# EAGLE schematic LED_Array (EAGLE 8.6.1)
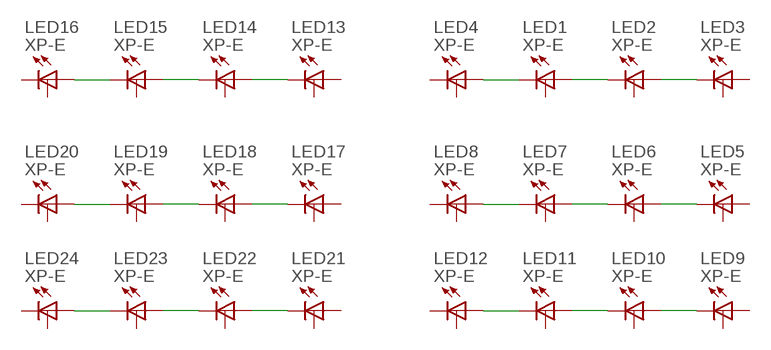
[diagram p0: schematic, sheet 1]

## Parts
LED1  XP-E  LED_W/THERM-XP-E  [CREE-XLAMP-XP-E]
LED2  XP-E  LED_W/THERM-XP-E  [CREE-XLAMP-XP-E]
LED3  XP-E  LED_W/THERM-XP-E  [CREE-XLAMP-XP-E]
LED4  XP-E  LED_W/THERM-XP-E  [CREE-XLAMP-XP-E]
LED5  XP-E  LED_W/THERM-XP-E  [CREE-XLAMP-XP-E]
LED6  XP-E  LED_W/THERM-XP-E  [CREE-XLAMP-XP-E]
LED7  XP-E  LED_W/THERM-XP-E  [CREE-XLAMP-XP-E]
LED8  XP-E  LED_W/THERM-XP-E  [CREE-XLAMP-XP-E]
LED9  XP-E  LED_W/THERM-XP-E  [CREE-XLAMP-XP-E]
LED10  XP-E  LED_W/THERM-XP-E  [CREE-XLAMP-XP-E]
LED11  XP-E  LED_W/THERM-XP-E  [CREE-XLAMP-XP-E]
LED12  XP-E  LED_W/THERM-XP-E  [CREE-XLAMP-XP-E]
LED13  XP-E  LED_W/THERM-XP-E  [CREE-XLAMP-XP-E]
LED14  XP-E  LED_W/THERM-XP-E  [CREE-XLAMP-XP-E]
LED15  XP-E  LED_W/THERM-XP-E  [CREE-XLAMP-XP-E]
LED16  XP-E  LED_W/THERM-XP-E  [CREE-XLAMP-XP-E]
LED17  XP-E  LED_W/THERM-XP-E  [CREE-XLAMP-XP-E]
LED18  XP-E  LED_W/THERM-XP-E  [CREE-XLAMP-XP-E]
LED19  XP-E  LED_W/THERM-XP-E  [CREE-XLAMP-XP-E]
LED20  XP-E  LED_W/THERM-XP-E  [CREE-XLAMP-XP-E]
LED21  XP-E  LED_W/THERM-XP-E  [CREE-XLAMP-XP-E]
LED22  XP-E  LED_W/THERM-XP-E  [CREE-XLAMP-XP-E]
LED23  XP-E  LED_W/THERM-XP-E  [CREE-XLAMP-XP-E]
LED24  XP-E  LED_W/THERM-XP-E  [CREE-XLAMP-XP-E]

## Nets
N$1: LED1.C LED1.C@1(C) LED4.A LED4.A@1(A)
N$2: LED1.A LED1.A@1(A) LED2.C LED2.C@1(C)
N$3: LED2.A LED2.A@1(A) LED3.C LED3.C@1(C)
N$4: LED7.C LED7.C@1(C) LED8.A LED8.A@1(A)
N$5: LED6.C LED6.C@1(C) LED7.A LED7.A@1(A)
N$6: LED5.C LED5.C@1(C) LED6.A LED6.A@1(A)
N$7: LED11.C LED11.C@1(C) LED12.A LED12.A@1(A)
N$8: LED10.C LED10.C@1(C) LED11.A LED11.A@1(A)
N$9: LED9.C LED9.C@1(C) LED10.A LED10.A@1(A)
N$10: LED15.C LED15.C@1(C) LED16.A LED16.A@1(A)
N$11: LED14.C LED14.C@1(C) LED15.A LED15.A@1(A)
N$12: LED13.C LED13.C@1(C) LED14.A LED14.A@1(A)
N$13: LED19.C LED19.C@1(C) LED20.A LED20.A@1(A)
N$14: LED18.C LED18.C@1(C) LED19.A LED19.A@1(A)
N$15: LED17.C LED17.C@1(C) LED18.A LED18.A@1(A)
N$16: LED23.C LED23.C@1(C) LED24.A LED24.A@1(A)
N$17: LED22.C LED22.C@1(C) LED23.A LED23.A@1(A)
N$18: LED21.C LED21.C@1(C) LED22.A LED22.A@1(A)
Unconnected: LED1.THERM LED2.THERM LED3.A LED3.A@1(A) LED3.THERM LED4.C LED4.C@1(C) LED4.THERM LED5.A LED5.A@1(A) LED5.THERM LED6.THERM LED7.THERM LED8.C LED8.C@1(C) LED8.THERM LED9.A LED9.A@1(A) LED9.THERM LED10.THERM LED11.THERM LED12.C LED12.C@1(C) LED12.THERM LED13.A LED13.A@1(A) LED13.THERM LED14.THERM LED15.THERM LED16.C LED16.C@1(C) LED16.THERM LED17.A LED17.A@1(A) LED17.THERM LED18.THERM LED19.THERM LED20.C LED20.C@1(C) LED20.THERM LED21.A LED21.A@1(A) LED21.THERM LED22.THERM LED23.THERM LED24.C LED24.C@1(C) LED24.THERM

## Library data of the parts
LED1-LED24 = Tomaszewski:LED_W/THERM